# Altium project Modbus.PrjPcb
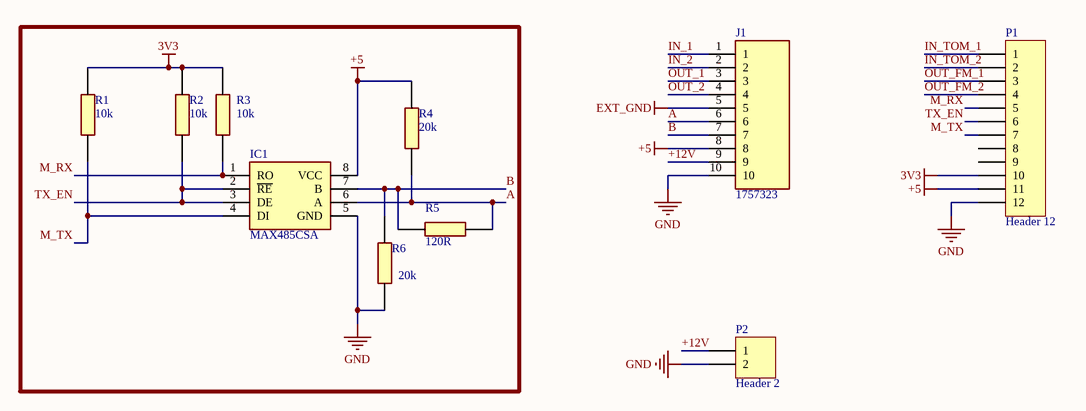
[diagram p0: Sheet3.SchDoc]
2 sheets, 26 parts. Net scope: global (net labels, ports and power ports of the same name join across sheets).
Board file: Modbus_Connecter.PcbDoc
Sheets:
  Sheet3.SchDoc
  Sheet4.SchDoc

## Sheet Sheet3.SchDoc
size A; SheetNumber: 1; SheetTotal: 2

### Parts
IC1  MAX485CSA  [SOIC127P600X175-8N]
J1  1757323  [1757323]
P1  Header 12  [HDR1X12]
P2  Header 2  [HDR1X2]
R1  10k  [RESC2012X60N]
R2  10k  [RESC2012X60N]
R3  10k  [RESC2012X60N]
R4  20k  [RESC2012X60N]
R5  120R  [RESC2012X60N]
R6  20k  [RESC2012X60N]

### Nets
3V3: P1.10 R1.2 R2.2 R3.2
+5: IC1.8(VCC) J1.8 P1.11 R4.2
EXT_GND: J1.5
GND: IC1.5(GND) J1.10 P1.12 P2.2 R6.1
+12V: J1.9 P2.1
A: IC1.6(A) J1.6 R4.1 R5.2
B: IC1.7(B) J1.7 R5.1 R6.2
IN_1: J1.1
IN_2: J1.2
IN_TOM_1: P1.1
IN_TOM_2: P1.2
M_RX: IC1.1(RO) P1.5 R3.1
M_TX: IC1.4(DI) P1.7 R1.1
OUT_1: J1.3
OUT_2: J1.4
OUT_FM_1: P1.3
OUT_FM_2: P1.4
TX_EN: IC1.2(~{RE}) IC1.3(DE) P1.6 R2.1

Not connected (* = marked no-connect by the designer): P1 8 9

### Library data of the parts
IC1 = MAX485CSA: Integrated Circuit; Manufacturer_Name: Analog Devices; Datasheet Link: https://datasheets.maximintegrated.com/en/ds/MAX1487-MAX491.pdf; Height: 1.75mm; Manufacturer_Part_Number: MAX485CSA; Mouser Part Number: N/A; Mouser Price/Stock: https://www.mouser.co.uk/ProductDetail/Maxim-Integrated/MAX485CSA?qs=LHmEVA8xxfbb%2FSUlm%252BHF3Q%3D%3D
J1 = 1757323: Connector; Manufacturer_Name: Phoenix Contact; Datasheet Link: http://www.phoenixcontact.com/de/produkte/1757323/pdf; Height: 8.72mm; Manufacturer_Part_Number: 1757323; Mouser Part Number: 651-1757323; Mouser Price/Stock: https://www.mouser.co.uk/ProductDetail/Phoenix-Contact/1757323?qs=o3rrLWFGhRnEONaPlNkZ%252Bw%3D%3D; Arrow Part Number: 1757323; Arrow Price/Stock: https://www.arrow.com/en/products/1757323/phoenix-contact
P1 = Header 12: Header, 12-Pin; LatestRevisionDate: 17-Jul-2002; LatestRevisionNote: Re-released for DXP Platform.; Publisher: Altium Limited
P2 = Header 2: Header, 2-Pin; LatestRevisionDate: 17-Jul-2002; LatestRevisionNote: Re-released for DXP Platform.; Publisher: Altium Limited
R1-R3 = CR0805-FX-1002ELF: Resistor; Manufacturer_Name: Bourns; Datasheet Link: https://www.bourns.com/pdfs/chpreztr.pdf; Height: 0.6mm; Manufacturer_Part_Number: CR0805-FX-1002ELF; Mouser Part Number: 652-CR0805FX-1002ELF; Mouser Price/Stock: https://www.mouser.co.uk/ProductDetail/Bourns/CR0805-FX-1002ELF?qs=tknLyCMIRbPr%252BDD0s0nG9g%3D%3D; Arrow Part Number: CR0805-FX-1002ELF; Arrow Price/Stock: https://www.arrow.com/en/products/cr0805-fx-1002elf/bourns?region=nac
R4 R6 = CR0805-FX-2002ELF: Resistor; Manufacturer_Name: Bourns; Datasheet Link: https://www.bourns.com/pdfs/chpreztr.pdf; Height: 0.6mm; Manufacturer_Part_Number: CR0805-FX-2002ELF; Mouser Part Number: 652-CR0805FX-2002ELF; Mouser Price/Stock: https://www.mouser.co.uk/ProductDetail/Bourns/CR0805-FX-2002ELF?qs=mEbcl8R%252Bl%252Bv8rqM1zQjjRA%3D%3D; Arrow Part Number: CR0805-FX-2002ELF; Arrow Price/Stock: https://www.arrow.com/en/products/cr0805-fx-2002elf/bourns?region=nac
R5 = CR0805-JW-121ELF: Resistor; Manufacturer_Name: Bourns; Datasheet Link: https://www.bourns.com/pdfs/chpreztr.pdf; Height: 0.6mm; Manufacturer_Part_Number: CR0805-JW-121ELF; Mouser Part Number: 652-CR0805JW-121ELF; Mouser Price/Stock: https://www.mouser.co.uk/ProductDetail/Bourns/CR0805-JW-121ELF?qs=wL7NMIHXUPnmcuStpLOKew%3D%3D; Arrow Part Number: CR0805-JW-121ELF; Arrow Price/Stock: https://www.arrow.com/en/products/cr0805-jw-121elf/bourns?region=nac

## Sheet Sheet4.SchDoc
size A; SheetNumber: 2; SheetTotal: 2
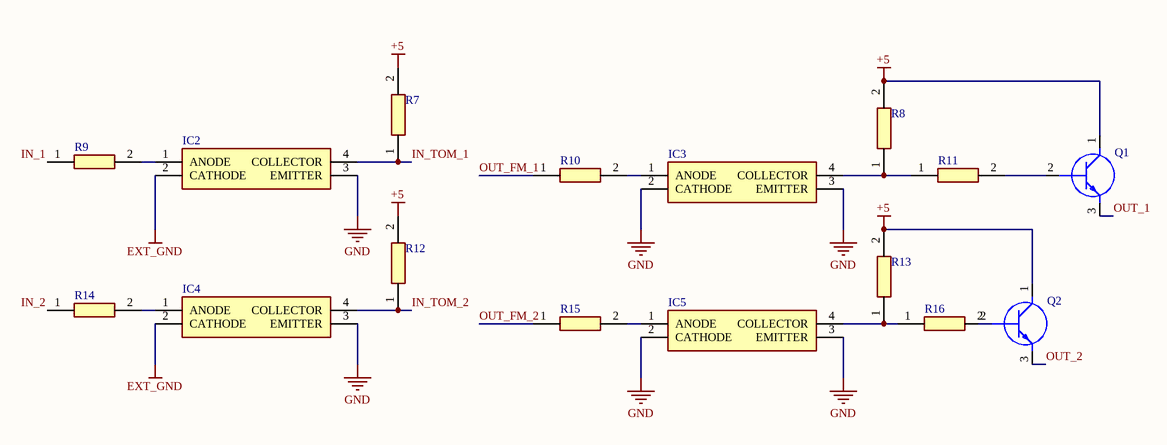
[diagram p1: Sheet4.SchDoc]

### Parts
IC2  PC817X2NSZ0F  [DIP762W60P254L458H400Q4N]  (value not drawn)
IC3  PC817X2NSZ0F  [DIP762W60P254L458H400Q4N]  (value not drawn)
IC4  PC817X2NSZ0F  [DIP762W60P254L458H400Q4N]  (value not drawn)
IC5  PC817X2NSZ0F  [DIP762W60P254L458H400Q4N]  (value not drawn)
Q1  BC547BG  [TO-92_(TO-226)]  (value not drawn)
Q2  BC547BG  [TO-92_(TO-226)]  (value not drawn)
R7  RN73C2A10KLTDF  [RESC2012X65N]  (value not drawn)
R8  RN73C2A10KLTDF  [RESC2012X65N]  (value not drawn)
R9  PCF0805R-1K0BI  [RESC2012X65N]  (value not drawn)
R10  PCF0805R-1K0BI  [RESC2012X65N]  (value not drawn)
R11  PCF0805R-1K0BI  [RESC2012X65N]  (value not drawn)
R12  RN73C2A10KLTDF  [RESC2012X65N]  (value not drawn)
R13  RN73C2A10KLTDF  [RESC2012X65N]  (value not drawn)
R14  PCF0805R-1K0BI  [RESC2012X65N]  (value not drawn)
R15  PCF0805R-1K0BI  [RESC2012X65N]  (value not drawn)
R16  PCF0805R-1K0BI  [RESC2012X65N]  (value not drawn)

### Nets
+5: Q1.1(C) Q2.1(C) R7.2 R8.2 R12.2 R13.2
EXT_GND: IC2.2(CATHODE) IC4.2(CATHODE)
GND: IC2.3(EMITTER) IC3.2(CATHODE) IC3.3(EMITTER) IC4.3(EMITTER) IC5.2(CATHODE) IC5.3(EMITTER)
IN_1: R9.1
IN_2: R14.1
IN_TOM_1: IC2.4(COLLECTOR) R7.1
IN_TOM_2: IC4.4(COLLECTOR) R12.1
OUT_1: Q1.3(E)
OUT_2: Q2.3(E)
OUT_FM_1: R10.1
OUT_FM_2: R15.1
NetIC2_1: IC2.1(ANODE) R9.2
NetIC3_1: IC3.1(ANODE) R10.2
NetIC3_4: IC3.4(COLLECTOR) R8.1 R11.1
NetIC4_1: IC4.1(ANODE) R14.2
NetIC5_1: IC5.1(ANODE) R15.2
NetIC5_4: IC5.4(COLLECTOR) R13.1 R16.1
NetQ1_2: Q1.2(B) R11.2
NetQ2_2: Q2.2(B) R16.2

### Library data of the parts
IC2-IC5 = PC817X2NSZ0F: Integrated Circuit; Manufacturer_Name: Sharp Microelectronics; Datasheet Link: https://datasheet.datasheetarchive.com/originals/distributors/Datasheets_SAMA/458e45842a103a05998fcebbd6f7366e.pdf; Height: 4mm; Manufacturer_Part_Number: PC817X2NSZ0F; Mouser Part Number: N/A; Mouser Price/Stock: https://www.mouser.co.uk/ProductDetail/Sharp-Microelectronics/PC817X2NSZ0F?qs=6kT3pPPHxnU7uYWM8Yy85A%3D%3D
Q1 Q2 = BC547BG: Transistor BJT NPN; Manufacturer_Name: onsemi; Datasheet Link: https://www.onsemi.com/download/data-sheet/pdf/BC546-D.PDF; Height: 5.33mm; Manufacturer_Part_Number: BC547BG; Mouser Part Number: N/A; Mouser Price/Stock: http://www.mouser.com/Search/ProductDetail.aspx?qs=NSmgnqlvnz5NIKIycfR5CQ%3d%3d; Arrow Part Number: BC547BG; Arrow Price/Stock: http://www.arrow.com/en/products/bc547bg/on-semiconductor
R7 R8 R12 R13 = RN73C2A10KLTDF: Resistor; Manufacturer_Name: TE Connectivity; Datasheet Link: http://docs-europe.electrocomponents.com/webdocs/1488/0900766b814885e5.pdf; Height: 0.65mm; Manufacturer_Part_Number: RN73C2A10KLTDF; Mouser Part Number: 279-RN73C2A10KLTDF; Mouser Price/Stock: https://www.mouser.co.uk/ProductDetail/TE-Connectivity-Holsworthy/RN73C2A10KLTDF?qs=1Hpg7qxOs69sC8pHBMR1GQ%3D%3D
R9-R11 R14-R16 = PCF0805R-1K0BI: Resistor; Manufacturer_Name: TT Electronics; Datasheet Link: https://componentsearchengine.com/Datasheets/1/PCF0805-13-10KBT1.pdf; Height: 0.65mm; Manufacturer_Part_Number: PCF0805R-1K0BI; Mouser Part Number: 756-PCF0805R1K0BI; Mouser Price/Stock: https://www.mouser.co.uk/ProductDetail/Welwyn-Components-TT-Electronics/PCF0805R-1K0BI?qs=mbEfOQsdCzdnsA0Coprz5g%3D%3D

## Nets that join several sheets
+5: Sheet3 (IC1.8 J1.8 P1.11 R4.2), Sheet4 (6 pins)
EXT_GND: Sheet3 (J1.5), Sheet4 (IC2.2 IC4.2)
GND: Sheet3 (5 pins), Sheet4 (6 pins)
IN_1: Sheet3 (J1.1), Sheet4 (R9.1)
IN_2: Sheet3 (J1.2), Sheet4 (R14.1)
IN_TOM_1: Sheet3 (P1.1), Sheet4 (IC2.4 R7.1)
IN_TOM_2: Sheet3 (P1.2), Sheet4 (IC4.4 R12.1)
OUT_1: Sheet3 (J1.3), Sheet4 (Q1.3)
OUT_2: Sheet3 (J1.4), Sheet4 (Q2.3)
OUT_FM_1: Sheet3 (P1.3), Sheet4 (R10.1)
OUT_FM_2: Sheet3 (P1.4), Sheet4 (R15.1)